# Altium schematic sheet PlusBit_MCU.SchDoc
size A3; SheetNumber: 1; SheetTotal: 5
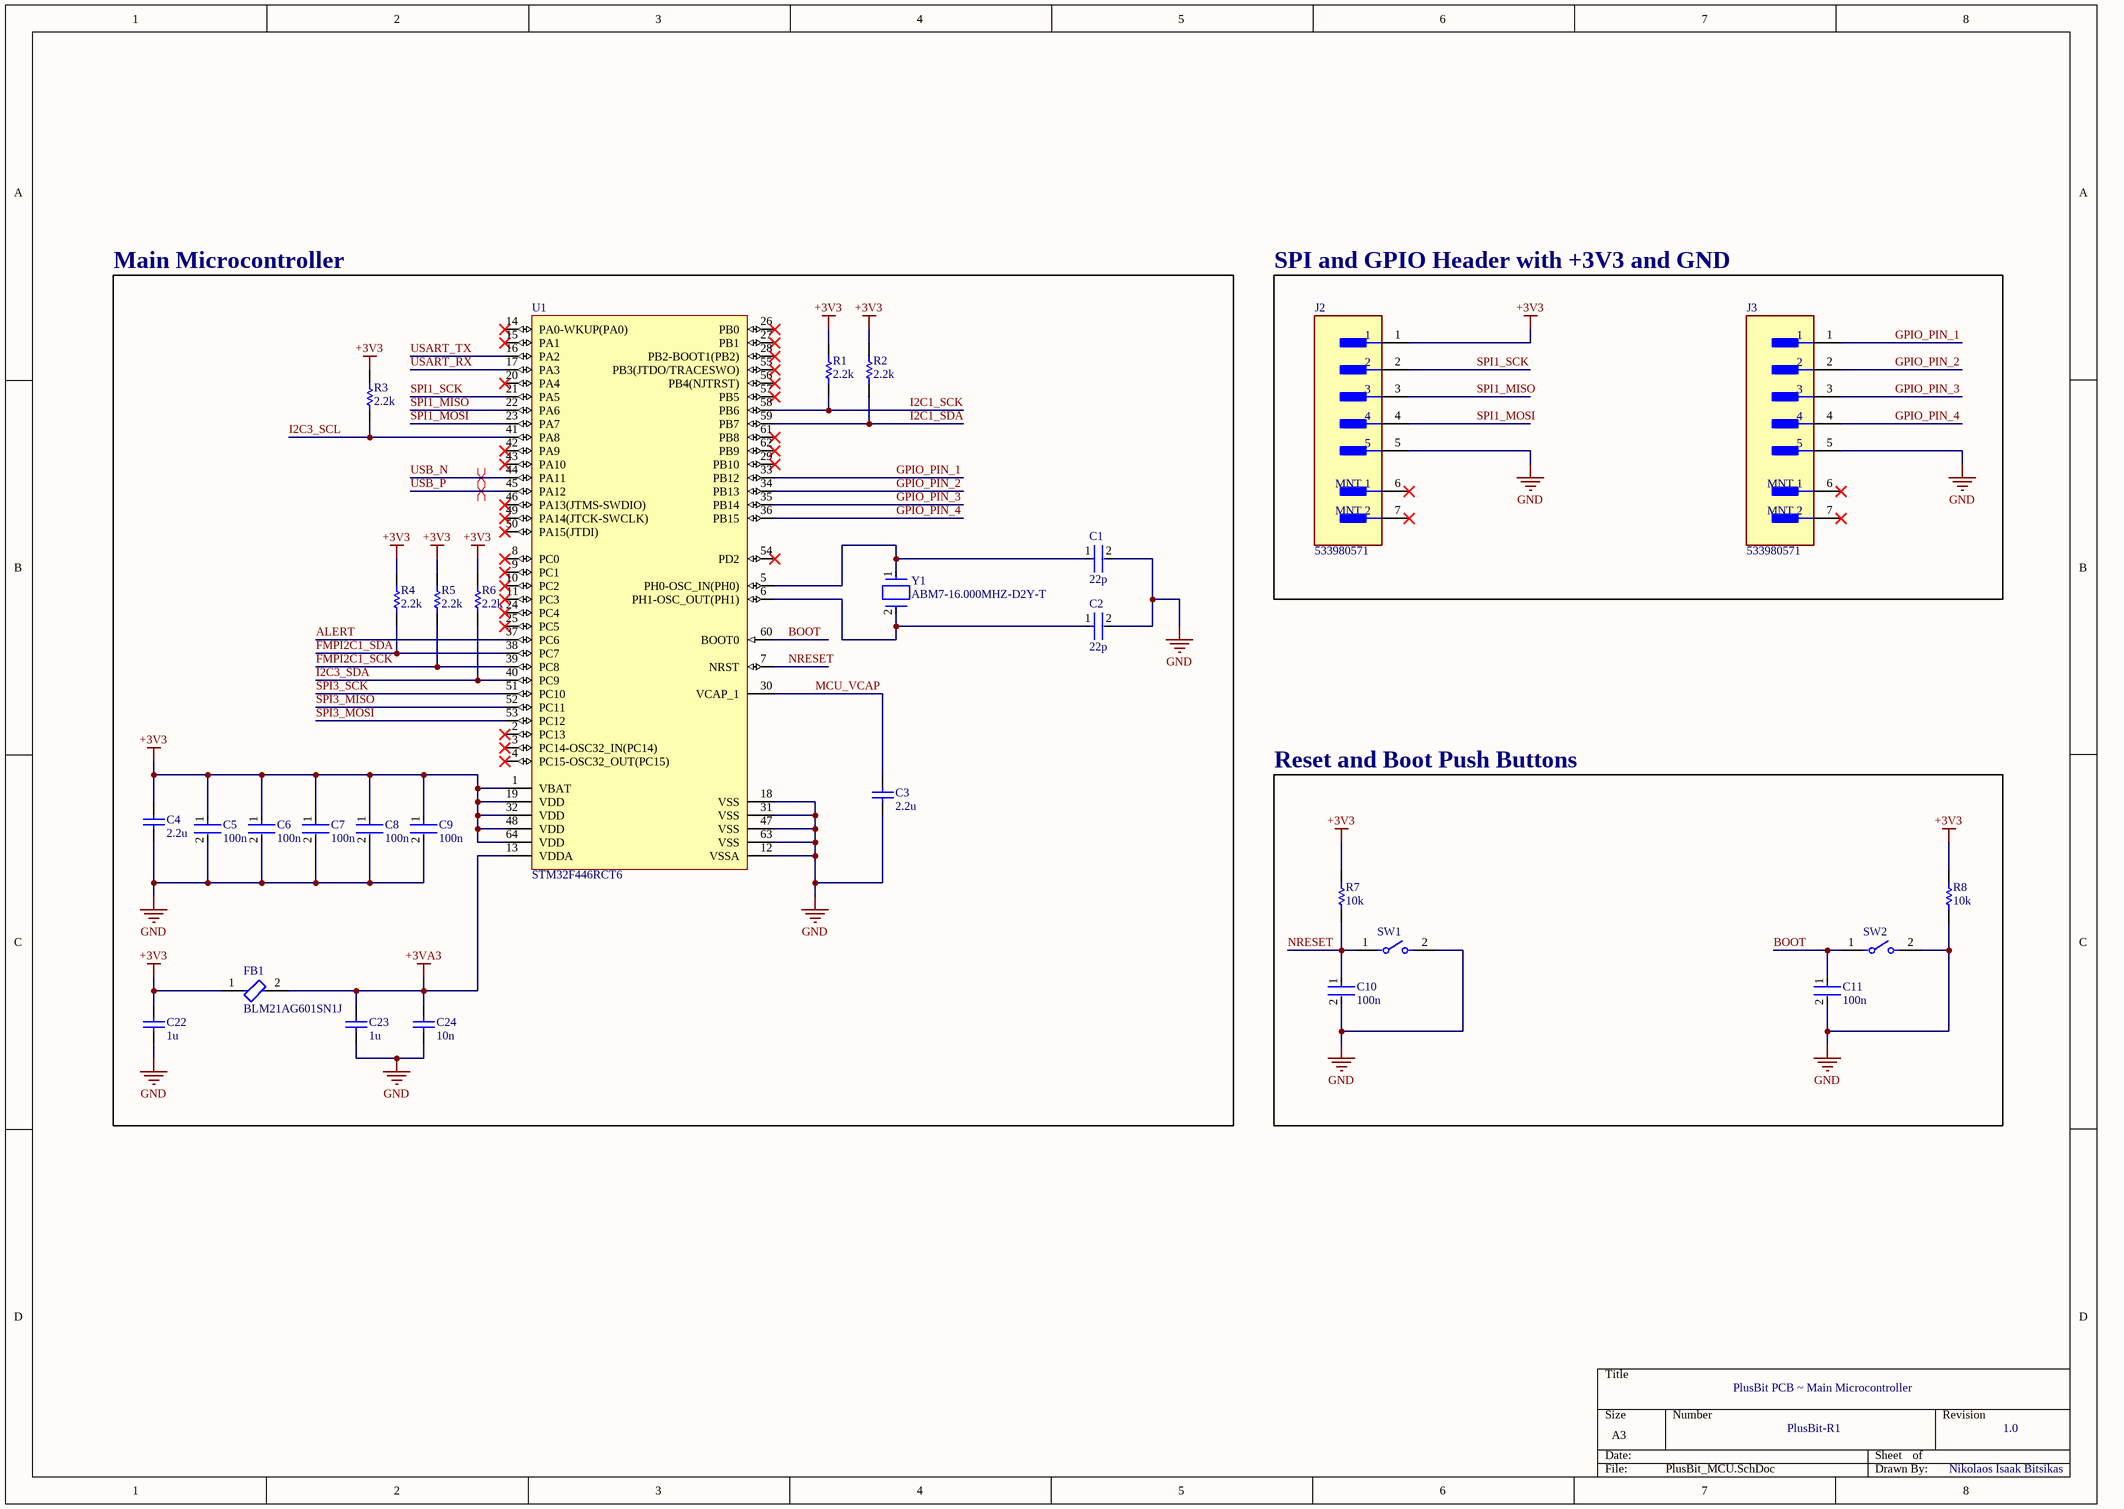
[diagram p0: PlusBit_MCU.SchDoc]

## Parts
C1  22p  [FP-C1206C-EB-MFG]
C2  22p  [FP-C1206C-EB-MFG]
C3  2.2u  [CAPC2013X145X50ML20T25]
C4  2.2u  [CAPC2013X145X50ML20T25]
C5  100n  [FP-C0402-BB-MFG]
C6  100n  [FP-C0402-BB-MFG]
C7  100n  [FP-C0402-BB-MFG]
C8  100n  [FP-C0402-BB-MFG]
C9  100n  [FP-C0402-BB-MFG]
C10  100n  [FP-C0402-BB-MFG]
C11  100n  [FP-C0402-BB-MFG]
C22  1u  [CAPC2013X135X45LL10T25]
C23  1u  [CAPC2013X135X45LL10T25]
C24  10n  [CAPC2013X88X50LL20T25]
FB1  BLM21AG601SN1J  [FP-BLM21-0_2-t0_85-e0_5-IPC_A]
J2  533980571  [FP-533980571-MFG]
J3  533980571  [FP-533980571-MFG]
R1  2.2k  [RESC1608X55X25LL10T15]
R2  2.2k  [RESC1608X55X25LL10T15]
R3  2.2k  [RESC1608X55X25LL10T15]
R4  2.2k  [RESC1608X55X25LL10T15]
R5  2.2k  [RESC1608X55X25LL10T15]
R6  2.2k  [RESC1608X55X25LL10T15]
R7  10k  [RESC2013X60X35NL10T20]
R8  10k  [RESC1608X55X25ML10T15]
SW1  FSM2JART  [FP-FSM2JART-MFG]  (value not drawn)
SW2  FSM2JART  [FP-FSM2JART-MFG]  (value not drawn)
U1  STM32F446RCT6  [STM-LQFP64_L]
Y1  ABM7-16.000MHZ-D2Y-T  [FP-ABM7-MFG]

## Blocks framed on the sheet
Main Microcontroller: C1-C9 C22-C24 FB1 R1-R6 U1 Y1
SPI and GPIO Header with +3V3 and GND: J2 J3
Reset and Boot Push Buttons: C10 C11 R7 R8 SW1 SW2

## Nets
+3V3: C4.2 C5.1 C6.1 C7.1 C8.1 C9.1 C22.2 FB1.1 J2.1 R1.2 R2.2 R3.2 R4.2 R5.2 R6.2 R7.2 R8.2 U1.1(VBAT) U1.19(VDD) U1.32(VDD) U1.48(VDD) U1.64(VDD)
+3VA3: C23.2 C24.2 FB1.2 U1.13(VDDA)
GND: C1.2 C2.2 C3.1 C4.1 C5.2 C6.2 C7.2 C8.2 C9.2 C10.2 C11.2 C22.1 C23.1 C24.1 J2.5 J3.5 R8.1 SW1.2 SW2.2 U1.12(VSSA) U1.18(VSS) U1.31(VSS) U1.47(VSS) U1.63(VSS)
ALERT: U1.37(PC6)
BOOT: C11.1 SW2.1 U1.60(BOOT0)
FMPI2C1_SCK: R5.1 U1.39(PC8)
FMPI2C1_SDA: R4.1 U1.38(PC7)
GPIO_PIN_1: J3.1 U1.33(PB12)
GPIO_PIN_2: J3.2 U1.34(PB13)
GPIO_PIN_3: J3.3 U1.35(PB14)
GPIO_PIN_4: J3.4 U1.36(PB15)
I2C1_SCK: R1.1 U1.58(PB6)
I2C1_SDA: R2.1 U1.59(PB7)
I2C3_SCL: R3.1 U1.41(PA8)
I2C3_SDA: R6.1 U1.40(PC9)
MCU_VCAP: C3.2 U1.30(VCAP_1)
NRESET: C10.1 R7.1 SW1.1 U1.7(NRST)
SPI1_MISO: J2.3 U1.22(PA6)
SPI1_MOSI: J2.4 U1.23(PA7)
SPI1_SCK: J2.2 U1.21(PA5)
SPI3_MISO: U1.52(PC11)
SPI3_MOSI: U1.53(PC12)
SPI3_SCK: U1.51(PC10)
USART_RX: U1.17(PA3)
USART_TX: U1.16(PA2)
USB_N: U1.44(PA11)
USB_P: U1.45(PA12)
NetC1_1: C1.1 U1.5(PH0-OSC_IN(PH0)) Y1.1
NetC2_1: C2.1 U1.6(PH1-OSC_OUT(PH1)) Y1.2

Not connected (* = marked no-connect by the designer): J2 6(MNT_1)* 7(MNT_2)*; J3 6(MNT_1)* 7(MNT_2)*; U1 2(PC13)* 3(PC14-OSC32_IN(PC14))* 4(PC15-OSC32_OUT(PC15))* 8(PC0)* 9(PC1)* 10(PC2)* 11(PC3)* 14(PA0-WKUP(PA0))* 15(PA1)* 20(PA4)* 24(PC4)* 25(PC5)* 26(PB0)* 27(PB1)* 28(PB2-BOOT1(PB2))* 29(PB10)* 42(PA9)* 43(PA10)* 46(PA13(JTMS-SWDIO))* 49(PA14(JTCK-SWCLK))* 50(PA15(JTDI))* 54(PD2)* 55(PB3(JTDO/TRACESWO))* 56(PB4(NJTRST))* 57(PB5)* 61(PB8)* 62(PB9)*

## Layout directives
differential pair: USB_N, USB_P

## Notes on the sheet
- PlusBit PCB ~ Main Microcontroller
- PlusBit-R1
- 1.0
- Nikolaos Isaak Bitsikas

## Library data of the parts
C1 C2 = CMP-1037-00978-2: 1206 22pF Ceramic Multilayer Capacitor; 50VDC; 125degC; C0G Dielec; +/-5% SMD; Manufacturer Part Number: C1206C220J5GACTU; Manufacturer: KEMET; Automotive Grade: Grade 0; Temperature Coefficient: 15%; Tolerance: 0.05; Voltage Rating: 50 V; Height: 0.88mm; Mouser Description: 1206 22pF Ceramic Multilayer Capacitor; 50VDC; 125degC; C0G Dielec; +/-5% SMD; Ipc Land Pattern Name: CAPC320160X78; Temperature Range High: +150°C; Automotive: Yes; Device Class L3: Ceramic Capacitors; ComponentLink2Description: Datasheet; Temperature: -55°C to +150°C; Lead Free: Yes; Category: Cap; Device Class L2: Capacitors; Device Class L1: Passive Components; Value: 22 pF; Capacitance: 22 pF; Digikey Description: 1206 22pF Ceramic Multilayer Capacitor; 50VDC; 125degC; C0G Dielec; +/-5% SMD; Octopart: https://octopart.com/c1206c220j5gactu-kemet-131912; Material: Ceramic; Temperature Characteristic: C0G; Package: C1206C-EB; RoHS: TRUE; ComponentLink2URL: https://content.kemet.com/datasheets/KEM_C1007_X8R_ULTRA_150C_SMD.pdf; Temperature Range Low: -55°C
C3 C4 = CMP-1036-04819-2: Part Number: C0805C225K9PACTU; Manufacturer: Kemet
C5-C9 C11 = CMP-2008-02046-2: CAP CER 0.1UF 10V X5R 0402; Manufacturer: Kemet; Manufacturer Part Number: C0402C104K8PACTU; Material: Ceramic; Capacitance: 0.10 μF; Temperature Coefficient: 15%; Tolerance: 0.1; Value: 0.10 μF; Package: C0402-BB; Temperature: -55°C to +125°C; ComponentLink2Description: Datasheet; Temperature Characteristic: X5R; Device Class L1: Passive Components; Height: 0.55mm; Lead Free: Yes; ComponentLink2URL: https://content.kemet.com/datasheets/KEM_C1002_X7R_SMD.pdf; Device Class L2: Capacitors; Temperature Range Low: -55°C; Temperature Range High: +125°C; RoHS: TRUE; Octopart: https://octopart.com/c0402c104k8pactu-kemet-140039; Automotive: No; Mouser Description: Capacitor 100 nF 10 VDC 0402; Category: Cap; Voltage Rating: 10 V; Digikey Description: CAP CER 0.1UF 10V X5R 0402; Ipc Land Pattern Name: CAPC10050X50; Device Class L3: Ceramic Capacitors
C10 = CMP-2008-02108-2: CAP CER 0.1UF 16V X7R 0402; Manufacturer: Kemet; Manufacturer Part Number: C0402C104K4RACTU; Value: 0.10 μF; Tolerance: 0.1; Material: Ceramic; Temperature Coefficient: 15%; Voltage Rating: 16 V; Package: C0402-BB; Automotive: No; Ipc Land Pattern Name: CAPC10050X50; Device Class L3: Ceramic Capacitors; Capacitance: 0.10 μF; Octopart: https://octopart.com/c0402c104k4ractu-kemet-94158; Temperature Characteristic: X7R; Mouser Description: Cap Ceramic 0.1uF 16V X7R 10% SMD 0402 125?C Paper T/R - Tape and Reel (Alt: C0402C104K4RAC TU); ComponentLink2Description: Datasheet; Temperature Range Low: -55°C; RoHS: TRUE; Device Class L1: Passive Components; Temperature Range High: +125°C; Device Class L2: Capacitors; ComponentLink2URL: https://content.kemet.com/datasheets/KEM_C1002_X7R_SMD.pdf; Category: Cap; Height: 0.55mm; Temperature: -55°C to +125°C; Lead Free: Yes; Digikey Description: CAP CER 0.1UF 16V X7R 0402
C22 C23 = CMP-1036-04761-2: Manufacturer: Murata; Part Number: GRM21BR71H105KA12L
C24 = CMP-2007-00266-1: Manufacturer: Kemet; Part Number: C0805C103K5RACTU
FB1 = CMP-0686-00643-3: Chip Ferrite Bead, 0805, 600Ω @ 100MHz, 0.2Ω, 25%, 700mA; Current Rating: 600mA; Impedance: 600R; DC Resistance (DCR): 210mR; Max Current Rating: 200mA; Number of Circuits: 1; RoHS Compliant: Yes; Test Frequency: 100MHz; Number of Pins: 2; Case Code (Metric): 2012; Depth: 0.85mm; Height: 1.25mm; Case Code (Imperial): 0805; Case/Package: 0805; DC Current: 200mA; Max Operating Temperature: 125°C; Core Material: Ferrite; Length: 2.2mm; Tolerance: 25%; Packaging: Tape and Reel; Min Operating Temperature: -55°C; Radiation Hardening: No; Termination: Flat
J2 J3 = CMP-2000-05250-2: CONN HEADER SMD 5POS 1.25MM; Manufacturer: Molex; Number Of Contacts: 5; Conn Orientation: Vertical; Current Rating: 1A; Voltage Rating: 125V; Conn Gender: Male; Standoff Height: 0.05mm; Package: CONN_HDR5; Contact Material: Tin,Nickel; ComponentLink2Description: Datasheet; Footprint Url: https://www.molex.com/pdm_docs/sd/533980571_sd.pdf; Device Class L3: unset; Manufacturer Part Number: 533980571; Digikey Description: CONN HEADER SMD 5POS 1.25MM; Automotive: No; Lead Free: Yes; Device Class L1: Connectors; Temperature Range High: +105°C; Number Of Rows: 1; Mouser Description: Wire-To-Board Connector, Vertical, PicoBlade 53398 Series, Surface Mount, Header, 5, 1.25 mm; Octopart: https://octopart.com/53398-0571-molex-655292; ComponentLink2URL: https://www.molex.com/webdocs/datasheets/pdf/en-us/0533980571_PCB_HEADERS.pdf; Category: Conn; Device Class L2: Headers and Wire Housings; Pitch: 1.25mm; Ipc Land Pattern Name: HDRV5W64P254_1X5_2032X64X457; RoHS: TRUE; Temperature: -40°C to +105°C; Height: 4.9mm; Temperature Range Low: -40°C
R1-R6 = CMP-2000-06934-1: Thick Film Resistor, 2.2 KOhm, 100 mW, 50 V, +/- 1%, -55 to 155 degC, 2-Pin SMD (0603), RoHS, Tape and Reel; Manufacturer: Yageo; Resistance: 2.2kOhms; Temperature Coefficient: 100PPM/C; Voltage Rating: 50V; Power Rating: 100mW; Tolerance: 1%; Datasheet Version: Rev. 7, 05/2017; Case Code - mm: 1608; Series: RC; Mounting Technology: SurfaceMount; Package Description: 2-Pin Surface Mount Device, Body 1.6 x 0.8 mm; Case Code - in: 0603; Package Reference: 0603; Product: ThickFilmResistorsGeneralPurpose; Manufacturer URL: http://www.yageo.com/; Termination Style: SMD/SMT; Operating Temperature Range: -55Cto+155C; Datasheet URL: http://www.yageo.com/documents/recent/PYu-RC_Group_51_RoHS_L_7.pdf; Packaging: Reel
R7 = CMP-1659-00013-4: Chip Resistor, 10 KOhm, +/- 1%, 0.125 W, -55 to 155 degC, 0805 (2012 Metric), RoHS, Tape and Reel; Manufacturer: Yageo; Voltage Rating: 150 V; Mount: Surface Mount; ComponentLink1Description: Manufacturer URL; ComponentLink2URL: http://www.yageo.com/documents/recent/PYu-RC_Group_51_RoHS_L_04.pdf; Pins: 2; Length: 2 mm; Min Operating Temperature: -55 degC; Height: 0.5 mm; Mounting Technology: Surface Mount; RoHSCompliant: true; REACH SVHC: No SVHC; ComponentLink1URL: http://www.yageo.com/; Max Operating Temperature: 155 degC; PackageReference: 0805; DatasheetVersion: Rev. 4, 02/2016; Package Quantity: 5000; Packaging: Tape and Reel; ComponentLink2Description: Datasheet; PackageDescription: 2-Pin Surface Mounted Device, Body 2 x 1.25 mm
R8 = CMP-2000-05022-1: Resistor, 10 KOhm, +/- 5%, 100 mW, -55 to 155 degC, 0603 (1608 Metric), RoHS, Tape and Reel; Manufacturer: Yageo; Resistance: 10kOhms; Voltage Rating: 50V; Temperature Coefficient: 100PPM/C; Power Rating: 100mW; Package Reference: 603; Series: RC; Case Code - mm: 1608; Packaging: Reel; Datasheet URL: http://www.farnell.com/datasheets/443971.pdf; Datasheet Version: Rev. 4, 04/2009; Operating Temperature Range: -55Cto+155C; Product: ThickFilmResistorsGeneralPurpose; Package Description: 2-Pin Surface Mount Device, Body 1.6 x 0.8 mm; Manufacturer URL: http://www.yageo.com/; Case Code - in: 0603; Tolerance: 5%; Termination Style: SMD/SMT
SW1 SW2 = CMP-03407-000009-1: SWITCH TACTILE SPST-NO 0.05A 12V; Actuator Length: 0.7mm; Switch Function: Off-Mom; Throw Configuration: SPST; Electrical Life: 100000Cycles; Illumination Type: Non-Illuminated; Contact Resistance: 100mR; Operating Force: 260gf; Actuator Type: Standard; Actuator Material: Resin; Contact Current Rating: 50mA; Type: Switch; Contact Plating: Silver; ELV: Compliant; Lead Free: Lead Free; Max Voltage Rating (DC): 12V; Min Operating Temperature: -35°C; Mount: Through Hole; Series: FSMJRT; Max Operating Temperature: 105°C; RoHS Compliant: Yes; Termination: Solder; REACH SVHC: No SVHC; Contact Material: Copper Alloy; Orientation: Straight; Current Rating: 50mA; Package Quantity: 1000; Voltage Rating (DC): 12V; Packaging: Tape and Reel
U1 = CMP-0243-00216-1: ARM Cortex-M4 32-bit MCU+FPU, 256 KB Flash, 128 KB Internal RAM, 50 I/Os, 64-Pin LQFP, -40 to 85 degC, Tray; Operating Frequency(F) (Processor speed) (MHz): 180; Internal RAM Size (kB): 128; I/Os (High Current): 50; FLASH Size (Prog) (kB): 256; D/A Converter: 2; Supply Voltage(Vcc) min (V): 1.7; Mounting Technology: Surface Mount; DatasheetVersion: Rev. 6; ComponentLink1URL: http://www.st.com/; Package Description: LQFP64; ComponentLink1Description: Manufacturer URL; Packing: Tray; ComponentLink2Description: Datasheet; Core: ARM Cortex-M4; Package Reference: 64-Pin Low-profile Quad Flat Package, Body 10 x 10 mm, Pitch 0.5 mm; ComponentLink2URL: http://www.st.com/st-web-ui/static/active/en/resource/technical/document/datasheet/DM00141306.pdf
Y1 = CMP-27762-000095-1: Crystal 16MHz ±20ppm 18pF SMD-2 6mm x 3.5mm; ESR (Equivalent Series Resistance): 50R; Frequency Stability: 30ppm; Width: 3.3mm; Frequency: 16MHz; Radiation Hardening: No; Height: 0.055inch; Tolerance: 20ppm; Length: 6mm; Case/Package: CSMD; Lead Free: Lead Free; Min Operating Temperature: -40°C; Termination: SMD/SMT; Operating Frequency: 16 MHz; Resistor Type: Ceramic; Packaging: Tape and Reel; Mount: Surface Mount; Load Capacitance: 18pF; Frequency Tolerance: 20ppm; Depth: 3.5mm; Series: ABM7; Package Quantity: 1000; Max Operating Temperature: 85°C; Number of Pins: 2